# EAGLE design Frontpanel (EAGLE 7.7.0)
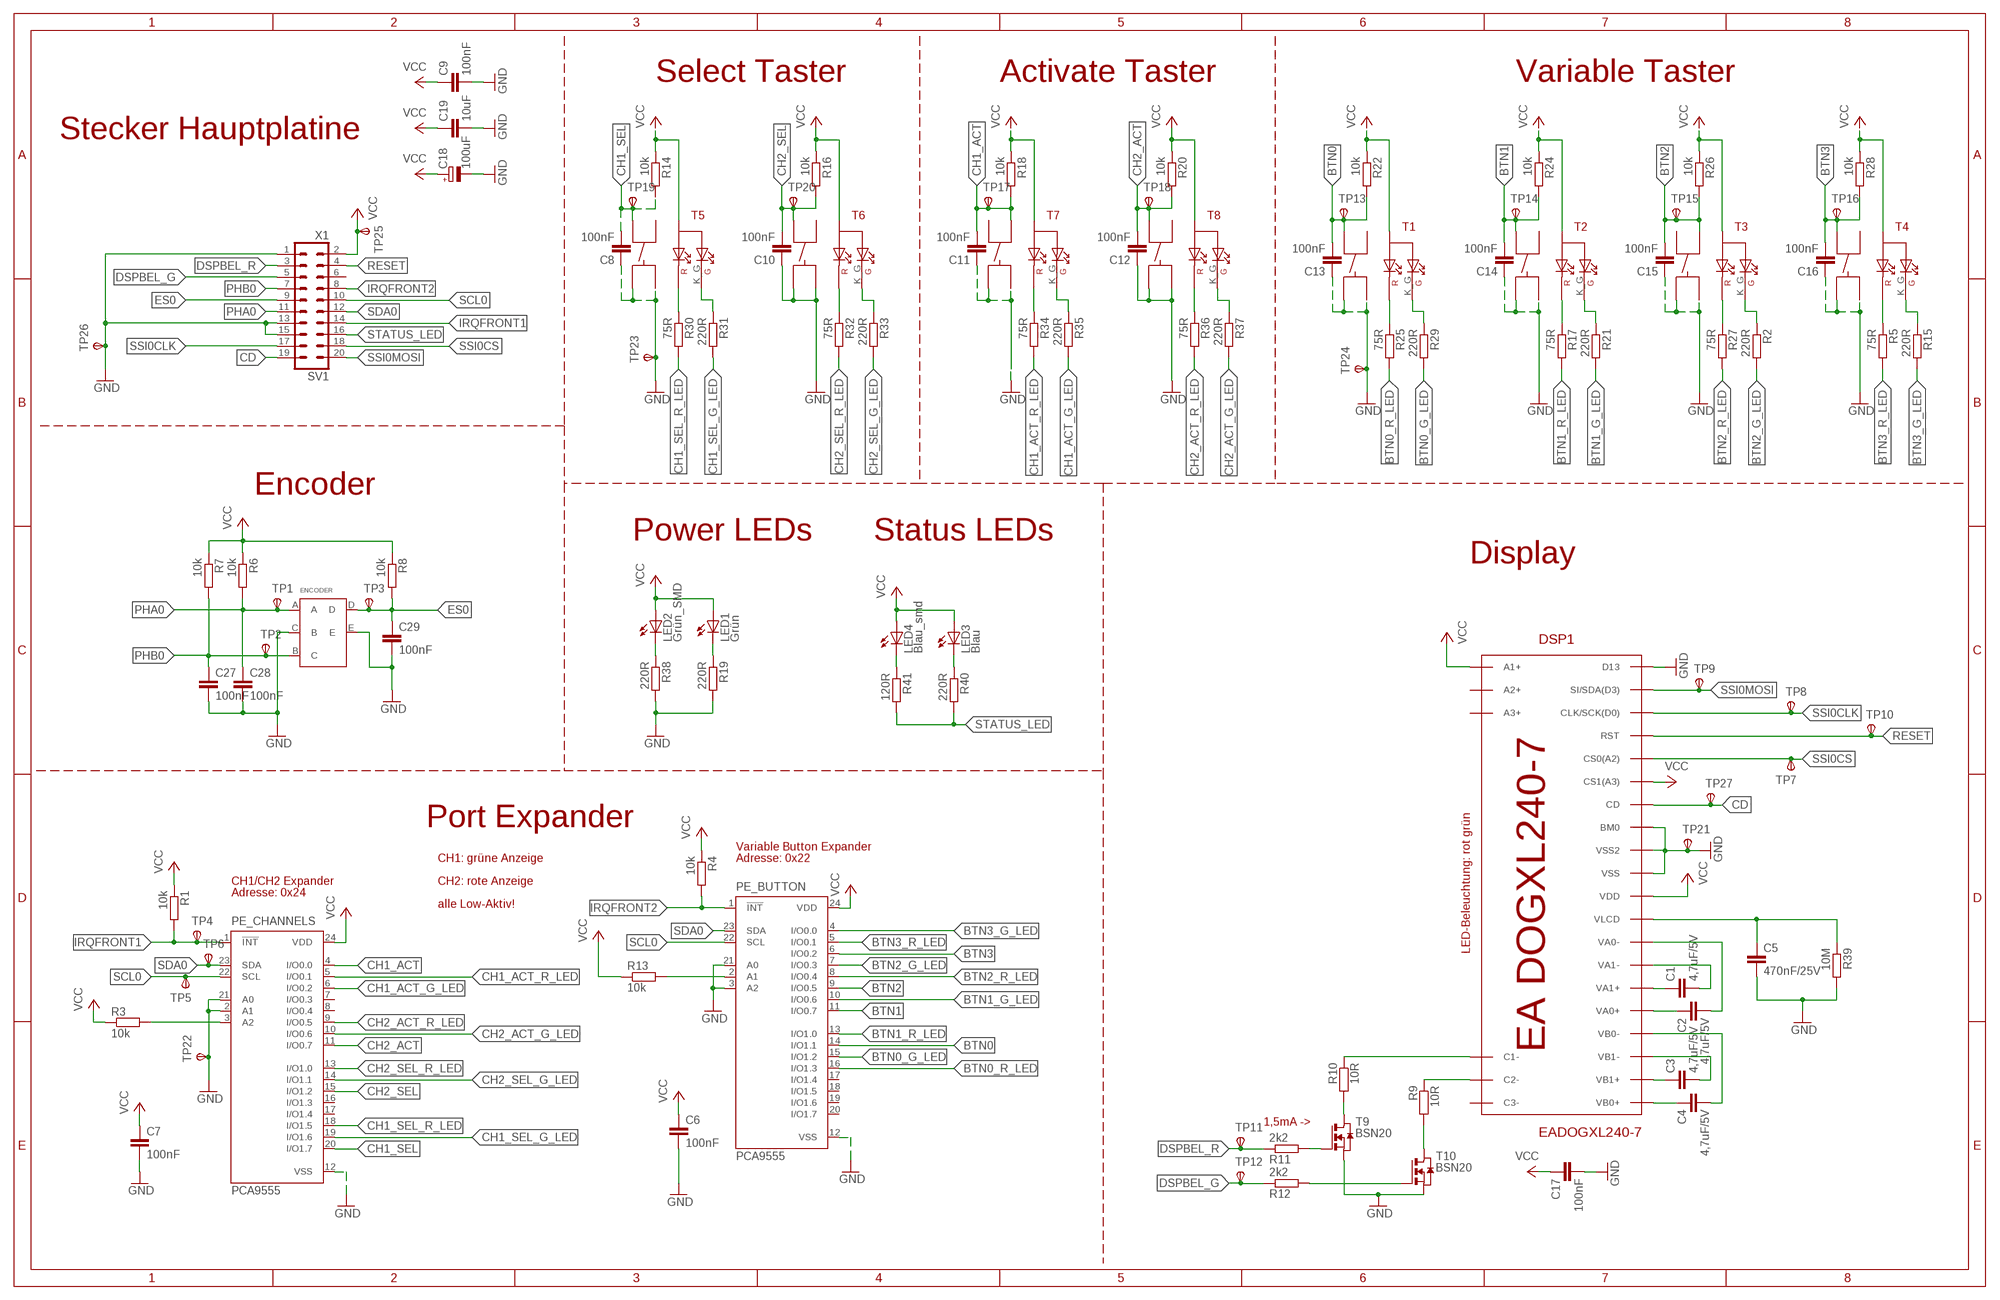
[diagram p0: schematic, sheet 1]

## Parts
C1  4,7uF/5V  C-EUC0805  [C0805]
C2  4,7uF/5V  C-EUC0805  [C0805]
C3  4,7uF/5V  C-EUC0805  [C0805]
C4  4,7uF/5V  C-EUC0805  [C0805]
C5  470nF/25V  C-EUC0603  [C0603]
C6  100nF  C-EUC0603  [C0603]
C7  100nF  C-EUC0603  [C0603]
C8  100nF  C-EUC0603  [C0603]
C9  100nF  C-EUC0603  [C0603]
C10  100nF  C-EUC0603  [C0603]
C11  100nF  C-EUC0603  [C0603]
C12  100nF  C-EUC0603  [C0603]
C13  100nF  C-EUC0603  [C0603]
C14  100nF  C-EUC0603  [C0603]
C15  100nF  C-EUC0603  [C0603]
C16  100nF  C-EUC0603  [C0603]
C17  100nF  C-EUC0603  [C0603]
C18  100uF  CPOL-EUCT7343  [CT7343]
C19  10uF  C-EUC0805  [C0805]
C27  100nF  C-EUC0603  [C0603]
C28  100nF  C-EUC0603  [C0603]
C29  100nF  C-EUC0603  [C0603]
DSP1  EADOGXL240-7  [EADOGXL240-7]
ENCODER  ENCODER  [ENCODER]
LED1  Grün  LED5MM  [LED5MM]
LED2  Grün_SMD  LEDCHIP-LED0603  [CHIP-LED0603]
LED3  Blau  LED5MM  [LED5MM]
LED4  Blau_smd  LEDCHIP-LED0603  [CHIP-LED0603]
PE_BUTTON  PCA9555  [SSOP24_DBQ]
PE_CHANNELS  PCA9555  [SSOP24_DBQ]
R1  10k  R-EU_R0603  [R0603]
R2  220R  R-EU_R0603  [R0603]
R3  10k  R-EU_R0603  [R0603]
R4  10k  R-EU_R0603  [R0603]
R5  75R  R-EU_R0603  [R0603]
R6  10k  R-EU_R0603  [R0603]
R7  10k  R-EU_R0603  [R0603]
R8  10k  R-EU_R0603  [R0603]
R9  10R  R-EU_M1206  [M1206]
R10  10R  R-EU_M1206  [M1206]
R11  2k2  R-EU_R0603  [R0603]
R12  2k2  R-EU_R0603  [R0603]
R13  10k  R-EU_R0603  [R0603]
R14  10k  R-EU_R0603  [R0603]
R15  220R  R-EU_R0603  [R0603]
R16  10k  R-EU_R0603  [R0603]
R17  75R  R-EU_R0603  [R0603]
R18  10k  R-EU_R0603  [R0603]
R19  220R  R-EU_R0603  [R0603]
R20  10k  R-EU_R0603  [R0603]
R21  220R  R-EU_R0603  [R0603]
R22  10k  R-EU_R0603  [R0603]
R24  10k  R-EU_R0603  [R0603]
R25  75R  R-EU_R0603  [R0603]
R26  10k  R-EU_R0603  [R0603]
R27  75R  R-EU_R0603  [R0603]
R28  10k  R-EU_R0603  [R0603]
R29  220R  R-EU_R0603  [R0603]
R30  75R  R-EU_R0603  [R0603]
R31  220R  R-EU_R0603  [R0603]
R32  75R  R-EU_R0603  [R0603]
R33  220R  R-EU_R0603  [R0603]
R34  75R  R-EU_R0603  [R0603]
R35  220R  R-EU_R0603  [R0603]
R36  75R  R-EU_R0603  [R0603]
R37  220R  R-EU_R0603  [R0603]
R38  220R  R-EU_R0603  [R0603]
R39  10M  R-EU_R0603  [R0603]
R40  220R  R-EU_R0603  [R0603]
R41  120R  R-EU_R0603  [R0603]
SV1  X1  ML20  [ML20]
T1  TASTER_2FSH9_E_BEL  [TASTER_3FSH9_SMD_E]
T2  TASTER_2FSH9_E_BEL  [TASTER_3FSH9_SMD_E]
T3  TASTER_2FSH9_E_BEL  [TASTER_3FSH9_SMD_E]
T4  TASTER_2FSH9_E_BEL  [TASTER_3FSH9_SMD_E]
T5  TASTER_2FSH9_E_BEL  [TASTER_3FSH9_SMD_E]
T6  TASTER_2FSH9_E_BEL  [TASTER_3FSH9_SMD_E]
T7  TASTER_2FSH9_E_BEL  [TASTER_3FSH9_SMD_E]
T8  TASTER_2FSH9_E_BEL  [TASTER_3FSH9_SMD_E]
T9  BSN20  NMOSSOT23  [SOT-23]
T10  BSN20  NMOSSOT23  [SOT-23]
TP1  TPSB1,27  [B1,27]
TP2  TPSB1,27  [B1,27]
TP3  TPSB1,27  [B1,27]
TP4  TPSB1,27  [B1,27]
TP5  TPSB1,27  [B1,27]
TP6  TPSB1,27  [B1,27]
TP7  TPSB1,27  [B1,27]
TP8  TPSB1,27  [B1,27]
TP9  TPSB1,27  [B1,27]
TP10  TPSB1,27  [B1,27]
TP11  TPSB1,27  [B1,27]
TP12  TPSB1,27  [B1,27]
TP13  TPSB1,27  [B1,27]
TP14  TPSB1,27  [B1,27]
TP15  TPSB1,27  [B1,27]
TP16  TPSB1,27  [B1,27]
TP17  TPSB1,27  [B1,27]
TP18  TPSB1,27  [B1,27]
TP19  TPSB1,27  [B1,27]
TP20  TPSB1,27  [B1,27]
TP21  TPSB1,27  [B1,27]
TP22  TPSB1,27  [B1,27]
TP23  TPSB1,27  [B1,27]
TP24  TPSB1,27  [B1,27]
TP25  TPSB1,27  [B1,27]
TP26  TPSB1,27  [B1,27]
TP27  TPSB1,27  [B1,27]

## Nets
BTN0: C13.2 PE_BUTTON.14(I/O1.1) R22.2 T1.13 TP13.TP(PP)
BTN0_G_LED: PE_BUTTON.15(I/O1.2) R29.2
BTN0_R_LED: PE_BUTTON.16(I/O1.3) R25.2
BTN1: C14.2 PE_BUTTON.11(I/O0.7) R24.2 T2.13 TP14.TP(PP)
BTN1_G_LED: PE_BUTTON.10(I/O0.6) R21.2
BTN1_R_LED: PE_BUTTON.13(I/O1.0) R17.2
BTN2: C15.2 PE_BUTTON.9(I/O0.5) R26.2 T3.23 TP15.TP(PP)
BTN2_G_LED: PE_BUTTON.7(I/O0.3) R2.2
BTN2_R_LED: PE_BUTTON.8(I/O0.4) R27.2
BTN3: C16.2 PE_BUTTON.6(I/O0.2) R28.2 T4.13 TP16.TP(PP)
BTN3_G_LED: PE_BUTTON.4(I/O0.0) R15.2
BTN3_R_LED: PE_BUTTON.5(I/O0.1) R5.2
CD: DSP1.CD SV1.19 TP27.TP(PP)
CH1_ACT: C11.2 PE_CHANNELS.4(I/O0.0) R18.2 T7.23 TP17.TP(PP)
CH1_ACT_G_LED: PE_CHANNELS.6(I/O0.2) R35.2
CH1_ACT_R_LED: PE_CHANNELS.5(I/O0.1) R34.2
CH1_SEL: C8.2 PE_CHANNELS.20(I/O1.7) R14.2 T5.13 TP19.TP(PP)
CH1_SEL_G_LED: PE_CHANNELS.19(I/O1.6) R31.2
CH1_SEL_R_LED: PE_CHANNELS.18(I/O1.5) R30.2
CH2_ACT: C12.2 PE_CHANNELS.11(I/O0.7) R20.2 T8.13 TP18.TP(PP)
CH2_ACT_G_LED: PE_CHANNELS.10(I/O0.6) R37.2
CH2_ACT_R_LED: PE_CHANNELS.9(I/O0.5) R36.2
CH2_SEL: C10.2 PE_CHANNELS.15(I/O1.2) R16.2 T6.13 TP20.TP(PP)
CH2_SEL_G_LED: PE_CHANNELS.14(I/O1.1) R33.2
CH2_SEL_R_LED: PE_CHANNELS.13(I/O1.0) R32.2
DSPBEL_G: R12.1 SV1.5 TP12.TP(PP)
DSPBEL_R: R11.1 SV1.3 TP11.TP(PP)
ES0: C29.1 ENCODER.D R8.2 SV1.9 TP3.TP(PP)
GND: C5.2 C6.2 C7.2 C8.1 C9.2 C10.1 C11.1 C12.1 C13.1 C14.1 C15.1 C16.1 C17.2 C18.- C19.2 C27.2 C28.2 C29.2 DSP1.BM0 DSP1.D13 DSP1.VSS1(VSS) DSP1.VSS2 ENCODER.C(B) ENCODER.E PE_BUTTON.3(A2) PE_BUTTON.12(VSS) PE_BUTTON.21(A0) PE_CHANNELS.2(A1) PE_CHANNELS.12(VSS) PE_CHANNELS.21(A0) R19.2 R38.2 R39.2 SV1.1 SV1.13 SV1.15 T1.14 T1.24 T2.14 T2.24 T3.14 T3.24 T4.14 T4.24 T5.14 T5.24 T6.14 T6.24 T7.14 T7.24 T8.14 T8.24 T9.2(S) T10.2(S) TP21.TP(PP) TP22.TP(PP) TP23.TP(PP) TP24.TP(PP) TP26.TP(PP)
IRQFRONT1: PE_CHANNELS.1(!INT) R1.2 SV1.14 TP4.TP(PP)
IRQFRONT2: PE_BUTTON.1(!INT) R4.2 SV1.8
N$1: PE_CHANNELS.3(A2) R3.2
N$2: R27.1 T3.K_R(KR)
N$3: DSP1.C1- R10.1
N$4: PE_BUTTON.2(A1) R13.2
N$5: R11.2 T9.3(G)
N$6: DSP1.C2- R9.1
N$7: R12.2 T10.3(G)
N$8: R29.1 T1.K_G(KG)
N$9: R25.1 T1.K_R(KR)
N$10: R17.1 T2.K_R(KR)
N$11: C1.1 DSP1.VA1+
N$12: C2.1 DSP1.VA0+
N$13: C3.1 DSP1.VB1+
N$14: C4.1 DSP1.VB0+
N$15: C3.2 DSP1.VB1-
N$16: C4.2 DSP1.VB0-
N$17: R9.2 T10.1(D)
N$18: R10.2 T9.1(D)
N$19: R21.1 T2.K_G(KG)
N$20: R36.1 T8.K_R(KR)
N$21: R2.1 T3.K_G(KG)
N$22: R5.1 T4.K_R(KR)
N$23: R15.1 T4.K_G(KG)
N$24: R37.1 T8.K_G(KG)
N$25: R34.1 T7.K_R(KR)
N$26: R35.1 T7.K_G(KG)
N$27: R32.1 T6.K_R(KR)
N$28: R33.1 T6.K_G(KG)
N$29: R30.1 T5.K_R(KR)
N$30: R31.1 T5.K_G(KG)
N$31: C1.2 DSP1.VA1-
N$32: LED1.K(C) R19.1
N$33: LED2.C R38.1
N$34: C2.2 DSP1.VA0-
N$35: LED3.K(C) R40.1
N$36: C5.1 DSP1.VLCD R39.1
N$37: LED4.C R41.1
PHA0: C28.1 ENCODER.A R6.2 SV1.11 TP1.TP(PP)
PHB0: C27.1 ENCODER.B(C) R7.2 SV1.7 TP2.TP(PP)
RESET: DSP1.RST SV1.4 TP10.TP(PP)
SCL0: PE_BUTTON.22(SCL) PE_CHANNELS.22(SCL) SV1.10 TP5.TP(PP)
SDA0: PE_BUTTON.23(SDA) PE_CHANNELS.23(SDA) SV1.12 TP6.TP(PP)
SSI0CLK: DSP1.SCK(D0)(CLK/SCK(D0)) SV1.17 TP8.TP(PP)
SSI0CS: DSP1.CS0(A2) SV1.18 TP7.TP(PP)
SSI0MOSI: DSP1.SDA(D3)(SI/SDA(D3)) SV1.20 TP9.TP(PP)
STATUS_LED: R40.2 R41.2 SV1.16
VCC: C6.1 C7.1 C9.1 C17.1 C18.+ C19.1 DSP1.A1+ DSP1.CS1(A3) DSP1.VDD LED1.A LED2.A LED3.A LED4.A PE_BUTTON.24(VDD) PE_CHANNELS.24(VDD) R1.1 R3.1 R4.1 R6.1 R7.1 R8.1 R13.1 R14.1 R16.1 R18.1 R20.1 R22.1 R24.1 R26.1 R28.1 SV1.2 T1.A T2.A T3.A T4.A T5.A T6.A T7.A T8.A TP25.TP(PP)
Unconnected: DSP1.A2+ DSP1.A3+ DSP1.C3- PE_BUTTON.17(I/O1.4) PE_BUTTON.18(I/O1.5) PE_BUTTON.19(I/O1.6) PE_BUTTON.20(I/O1.7) PE_CHANNELS.7(I/O0.3) PE_CHANNELS.8(I/O0.4) PE_CHANNELS.16(I/O1.3) PE_CHANNELS.17(I/O1.4) SV1.6 T1.23 T2.23 T3.13 T4.23 T5.23 T6.23 T7.13 T8.23

## Notes on the sheet
- Select Taster | Activate Taster | Variable Taster
- Stecker Hauptplatine
- Encoder
- Power LEDs | Status LEDs
- Display
- Port Expander
- Variable Button Expander
- CH1: grüne Anzeige | Adresse: 0x22
- CH1/CH2 Expander | CH2: rote Anzeige
- Adresse: 0x24
- alle Low-Aktiv!
- LED-Beleuchtung: rot grün
- 1,5mA ->

## Library data of the parts
C1-C17 C19 C27-C29 = resistor:C-EU: CAPACITOR, European symbol
C18 = resistor:CPOL-EU: POLARIZED CAPACITOR, European symbol
DSP1 = ea_dogxl240-7:EADOGXL240-7
ENCODER = encoder:ENCODER
LED1-LED4 = led:LED: LED OSRAM: - CHIPLED LG R971, LG N971, LY N971, LG Q971, LY Q971, LO R971, LY R971 LH N974, LH R974 LS Q976, LO Q976, LY Q976 LO Q996 - Hyper CHIPLED LW Q18S LB Q993, LB Q99A, LB R99A - SideLED LS A670, LO A670, LY A670, LG A670, LP A670 LB A673, LV A673, LT A673, LW A673 LH A674 LY A675 LS A676, LA A676, LO A676, LY A676, LW A676 LS A679, LY A679, LG A679 - Hyper Micro SIDELED® LS Y876, LA Y876, LO Y876, LY Y876 LT Y87S - SmartLED LW L88C, LW L88S LB L89C, LB L89S, LG L890 LS L89K, LO L89K, LY L89K LS L896, LA L896, LO L896, LY L896 - TOPLED LS T670, LO T670, LY T670, LG T670, LP T670 LSG T670, LSP T670, LSY T670, LOP T670, LYG T670 LG T671, LOG T671, LSG T671 LB T673, LV T673, LT T673, LW T673 LH T674 LS T676, LA T676, LO T676, LY T676, LB T676, LH T676, LSB T676, LW T676 LB T67C, LV T67C, LT T67C, LS T67K, LO T67K, LY T67K, LW E67C LS E67B, LA E67B, LO E67B, LY E67B, LB E67C, LV E67C, LT E67C LW T67C LS T679, LY T679, LG T679 LS T770, LO T770, LY T770, LG T770, LP T770 LB T773, LV T773, LT T773, LW T773 LH T774 LS E675, LA E675, LY E675, LS T675 LS T776, LA T776, LO T776, LY T776, LB T776 LHGB T686 LT T68C, LB T68C - Hyper Mini TOPLED® LB M676 - Mini TOPLED Santana® LG M470 LS M47K, LO M47K, LY M47K Source: http://www.osram.convergy.de LUXEON: - LUMILED® LXK2-PW12-R00, LXK2-PW12-S00, LXK2-PW14-U00, LXK2-PW14-V00 LXK2-PM12-R00, LXK2-PM12-S00, LXK2-PM14-U00 LXK2-PE12-Q00, LXK2-PE12-R00, LXK2-PE12-S00, LXK2-PE14-T00, LXK2-PE14-U00 LXK2-PB12-K00, LXK2-PB12-L00, LXK2-PB12-M00, LXK2-PB14-N00, LXK2-PB14-P00, LXK2-PB14-Q00 LXK2-PR12-L00, LXK2-PR12-M00, LXK2-PR14-Q00, LXK2-PR14-R00 LXK2-PD12-Q00, LXK2-PD12-R00, LXK2-PD12-S00 LXK2-PH12-R00, LXK2-PH12-S00 LXK2-PL12-P00, LXK2-PL12-Q00, LXK2-PL12-R00 Source: www.luxeon.com KINGBRIGHT: KA-3528ASYC Source: www.kingbright.com
PE_BUTTON PE_CHANNELS = Taster_mec_3F:PCA9555
R1-R22 R24-R41 = resistor:R-EU_: RESISTOR, European symbol
SV1 = con-harting-ml:ML20: HARTING; OC_FARNELL: unknown; OC_NEWARK: unknown
T1-T8 = Taster_mec_3F:TASTER_2FSH9_E_BEL
T9 T10 = zetex:NMOSSOT23: MOS FET; OC_FARNELL: unknown; OC_NEWARK: unknown
TP1-TP27 = testpad:TPS: TEST PIN

## Net classes
0 default: clearance 0.205 mm

## Board
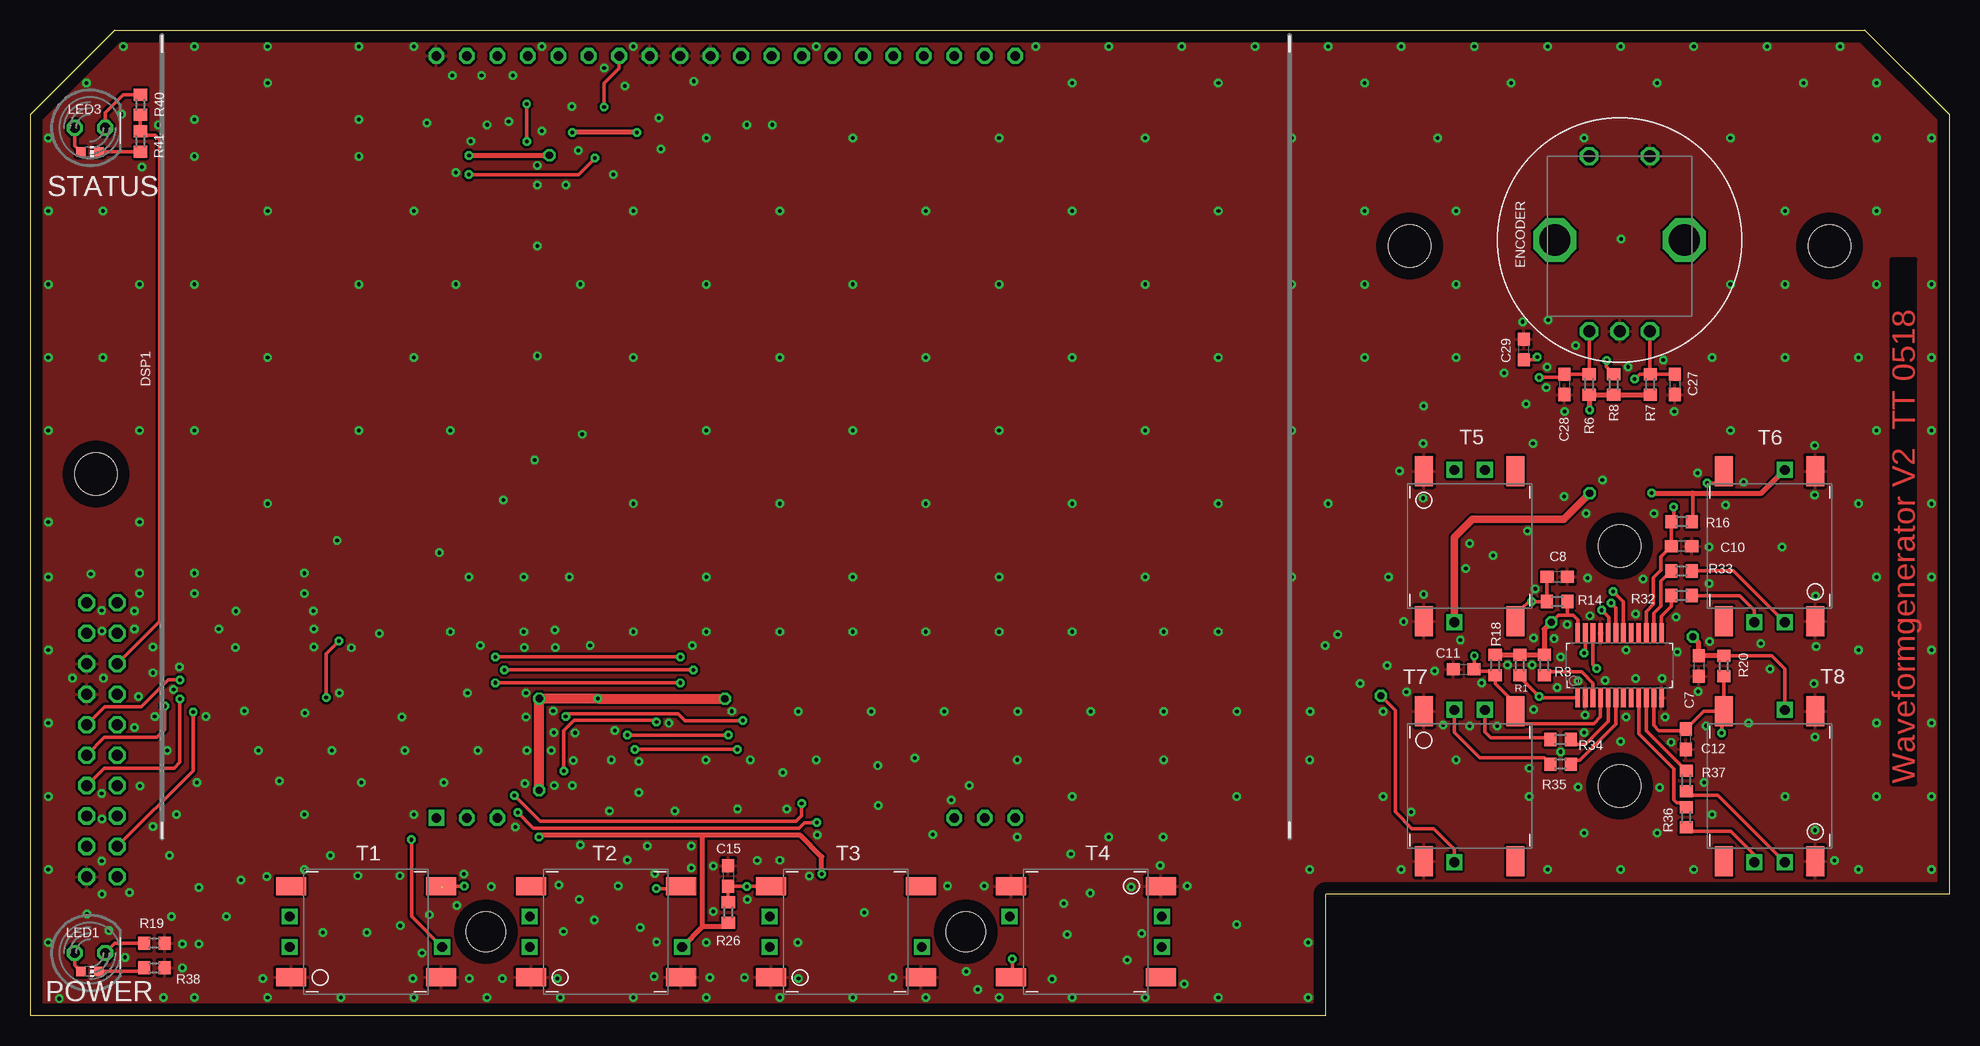
[diagram p1: board, top side]
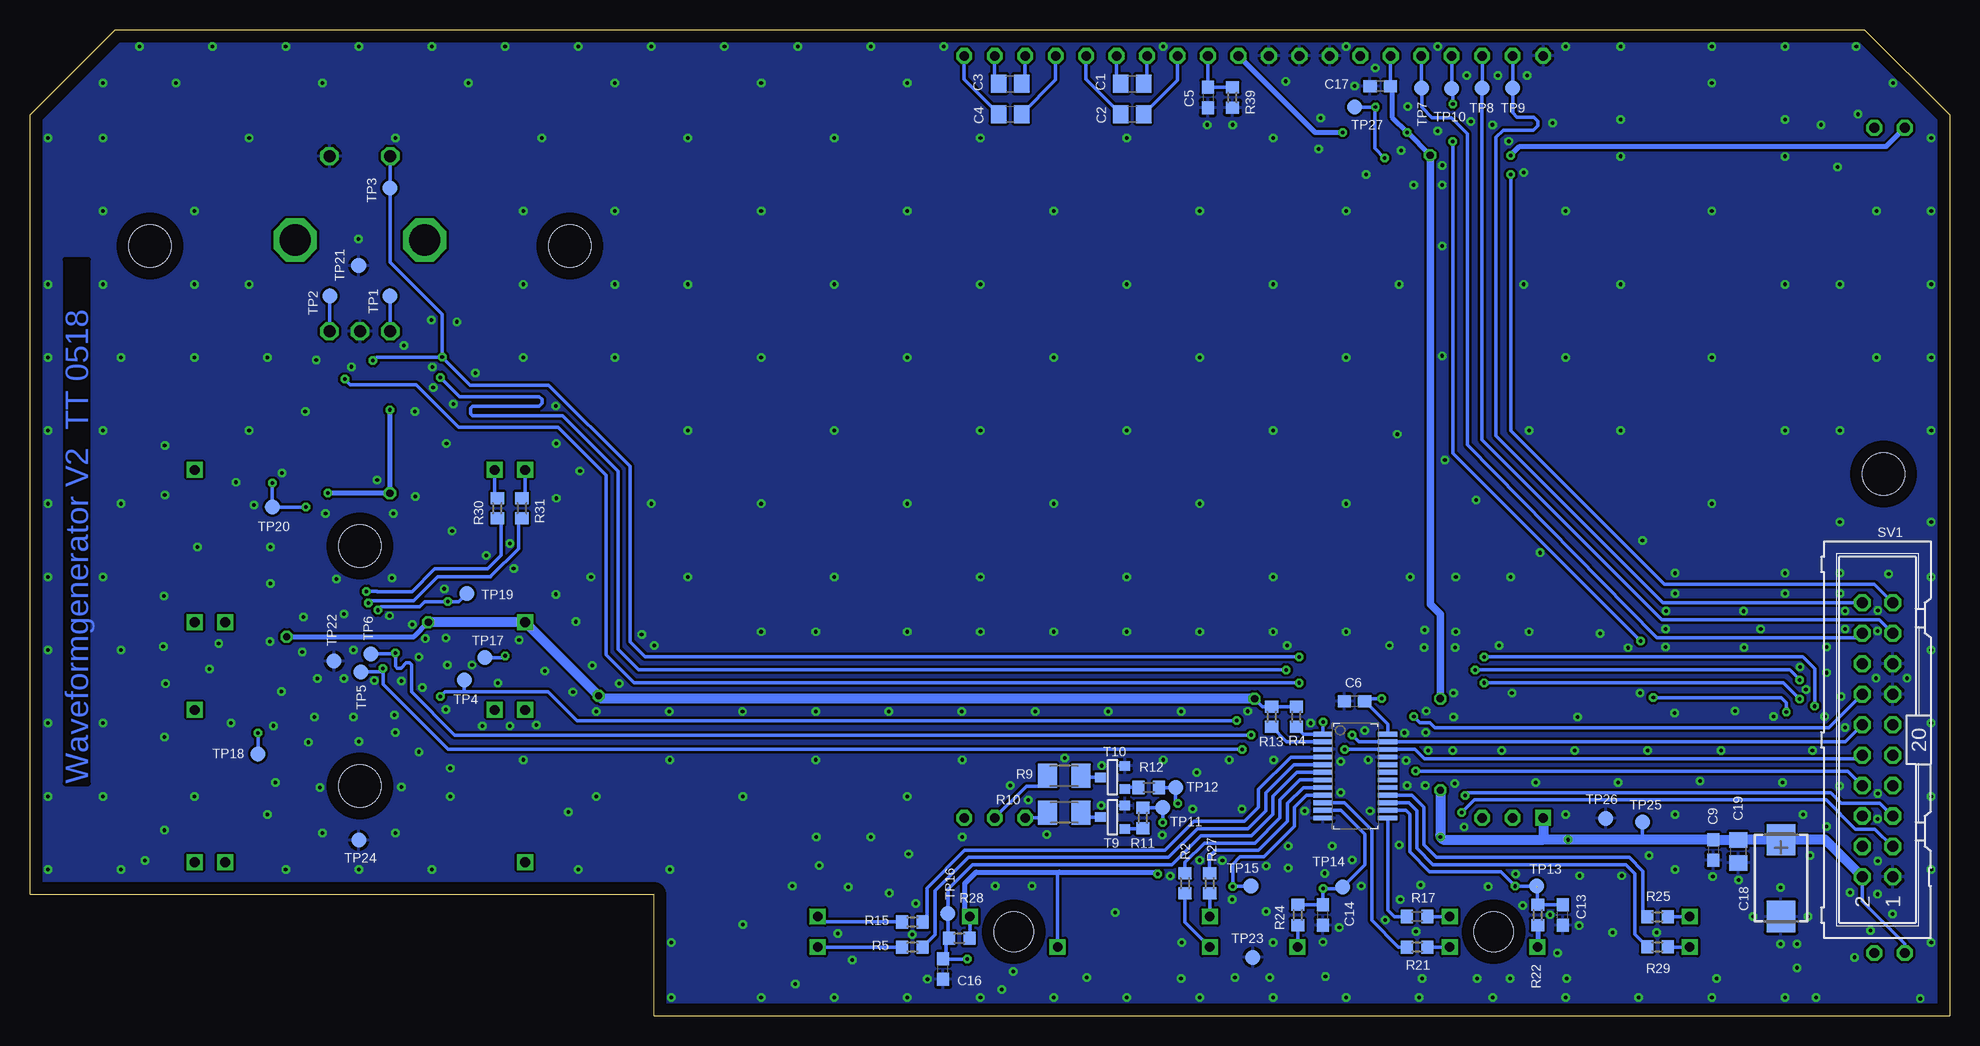
[diagram p2: board, bottom side, seen from below]

Size 160 x 82.15 mm. Coordinates in mm from the lower left corner, seen from the top.
Outline: 7.07,82.15 0,75.08 0,0 108,0 108,10.15 160,10.15 160,75.08 152.93,82.15 7.07,82.15
Copper layers (1*16): Top 0.035mm / dielectric 1.5mm / Bottom 0.035mm
Design rules "default *": minimum track width 6mil, minimum drill 0.3mm, track to track 6mil, track to pad 6mil, pad to pad 6mil, via to via 6mil, smd to smd 6mil, copper to edge 40mil, drill to drill 8mil, minimum pad ring 10mil, minimum via ring 8mil, stop-mask expansion 4mil, vias tented up to drill 0mil, thermal gap 10mil
Holes 3.3 mm at 78,7 38,7
Holes 3.5 mm at 5.5,45.15 132.5,39.15 132.5,19.15 150,64.15 115,64.15

### Footprints (pad centres in the part's own frame; a part is rotated, then mirrored left to right if it is on the bottom)
C0805 = smd 1.3 x 1.5: 1 -0.95,0; 2 0.95,0
C0603 = smd 1.1 x 1: 1 -0.85,0; 2 0.85,0
CT7343 = smd 2.6 x 2.4: + 3.2,0; - -3.2,0
EADOGXL240-7 = drill 0.8 square: A1+ 0,0 | drill 0.8 octagon: A2+ 2.54,0; A3+ 5.08,0; BM0 17.78,63.5; C1- 43.18,0; C2- 45.72,0; C3- 48.26,0; CD 15.24,63.5; CS0(A2) 10.16,63.5; CS1(A3) 12.7,63.5; D13 0,63.5; RST 7.62,63.5; SCK(D0) 5.08,63.5; SDA(D3) 2.54,63.5; VA0+ 38.1,63.5; VA0- 30.48,63.5; VA1+ 35.56,63.5; VA1- 33.02,63.5; VB0+ 48.26,63.5; VB0- 40.64,63.5; VB1+ 45.72,63.5; VB1- 43.18,63.5; VDD 25.4,63.5; VLCD 27.94,63.5; VSS1 22.86,63.5; VSS2 20.32,63.5
ENCODER = drill 1 octagon: A -2.54,-7.62; B 2.54,-7.62; C 0,-7.62; D -2.54,6.985; E 2.54,6.985 | drill 2.6 octagon: P$1 5.397,0; P$2 -5.397,0
LED5MM = drill 0.813 octagon: A -1.27,0; K 1.27,0
CHIP-LED0603 = smd 0.8 x 0.8: A 0,-0.75; C 0,0.75
SSOP24_DBQ = smd 0.4 x 1.6: 1 -3.493,-2.699; 2 -2.857,-2.699; 3 -2.223,-2.699; 4 -1.587,-2.699; 5 -0.953,-2.699; 6 -0.318,-2.699; 7 0.318,-2.699; 8 0.953,-2.699; 9 1.587,-2.699; 10 2.223,-2.699; 11 2.857,-2.699; 12 3.493,-2.699; 13 3.493,2.699; 14 2.857,2.699; 15 2.223,2.699; 16 1.587,2.699; 17 0.953,2.699; 18 0.318,2.699; 19 -0.318,2.699; 20 -0.953,2.699; 21 -1.587,2.699; 22 -2.223,2.699; 23 -2.857,2.699; 24 -3.493,2.699
R0603 = smd 1 x 1.1: 1 -0.85,0; 2 0.85,0
M1206 = smd 1.6 x 2: 1 -1.4,0; 2 1.4,0
ML20 = drill 0.914 octagon: 1 -11.43,-1.27; 2 -11.43,1.27; 3 -8.89,-1.27; 4 -8.89,1.27; 5 -6.35,-1.27; 6 -6.35,1.27; 7 -3.81,-1.27; 8 -3.81,1.27; 9 -1.27,-1.27; 10 -1.27,1.27; 11 1.27,-1.27; 12 1.27,1.27; 13 3.81,-1.27; 14 3.81,1.27; 15 6.35,-1.27; 16 6.35,1.27; 17 8.89,-1.27; 18 8.89,1.27; 19 11.43,-1.27; 20 11.43,1.27
TASTER_3FSH9_SMD_E = smd 1.5 x 2.5: 13 -3.8,6.25; 14 3.8,6.25; 23 -3.8,-6.25; 24 3.8,-6.25 | drill 0.8 square: A 1.27,6.35; K_G 1.27,-6.35; K_R -1.27,-6.35
SOT-23 = smd 0.787 x 0.889: 1 0.025,-1.016; 2 -0.94,1.016; 3 0.991,1.016
B1,27 = smd 1.27 x 1.27: TP 0,0

### Placement (x,y rotation side)
C1  68.12,77.68 0 bottom
C2  68.12,75.15 0 bottom
C3  78.3,77.68 0 bottom
C4  78.3,75.15 0 bottom
C5  61.83,76.53 270 bottom
C6  49.6,26.2 180 bottom
C7  139.1,29.15 270 top
C8  127.3,36.58 180 top
C9  19.7,13.82 270 bottom
C10  137.65,39.12 180 top
C11  119.5,28.88 0 top
C12  138.03,23.05 90 top
C13  32.25,8.4 90 bottom
C14  52.23,8.4 90 bottom
C15  58.2,11.65 270 top
C16  83.88,3.89 90 bottom
C17  47.45,77.47 180 bottom
C18  14.05,11.47 90 bottom
C19  17.62,13.7 270 bottom
C27  137.1,52.62 270 top
C28  127.9,52.62 270 top
C29  124.53,55.52 90 top
DSP1  33.87,16.5 0 top
ENCODER  132.5,64.65 0 top
LED1  5,5.24 0 top
LED2  5,3.7 270 top
LED3  5,74 0 top
LED4  5,72 270 top
PE_BUTTON  49.52,19.98 270 bottom
PE_CHANNELS  132.5,29.2 0 top
R1  124.17,29.23 270 top
R2  63.73,11.05 90 bottom
R3  126.22,29.23 270 top
R4  54.45,24.93 270 bottom
R5  86.45,5.72 0 bottom
R6  129.95,52.62 90 top
R7  135.05,52.62 90 top
R8  132,52.62 90 top
R9  73.79,19.99 0 bottom
R10  73.79,16.94 0 bottom
R11  67.24,16.5 270 bottom
R12  66.74,19.02 180 bottom
R13  56.5,24.93 270 bottom
R14  127.3,34.52 180 top
R15  86.45,7.82 0 bottom
R16  137.68,41.17 180 top
R17  44.38,8.28 180 bottom
R18  122.12,29.23 270 top
R19  10.38,6.05 0 top
R20  141.18,29.15 270 top
R21  44.38,5.72 180 bottom
R22  34.33,8.4 90 bottom
R24  54.33,8.4 90 bottom
R25  24.35,8.25 180 bottom
R26  58.2,8.61 90 top
R27  61.67,11.05 90 bottom
R28  82.54,6.46 180 bottom
R29  24.35,5.75 180 bottom
R30  121.05,42.3 270 bottom
R31  119,42.3 270 bottom
R32  137.65,35.02 180 top
R33  137.65,37.08 180 top
R34  127.58,23.02 0 top
R35  127.58,20.97 0 top
R36  138.05,16.55 90 top
R37  138.05,19.57 90 top
R38  10.38,4 0 top
R39  59.77,76.53 270 bottom
R40  9.2,75.92 270 top
R41  9.2,72.88 90 top
SV1  6,23 90 bottom
T1  28,7 270 top
T2  48,7 270 top
T3  68,7 270 top
T4  88,7 90 top
T5  120,39.15 180 top
T6  145,39.15 0 top
T7  120,19.15 180 top
T8  145,19.15 0 top
T9  69.76,16.57 270 bottom
T10  69.76,19.9 270 bottom
TP1  130,60 0 bottom
TP2  135,60 0 bottom
TP3  130,69 0 bottom
TP4  123.8,28 0 bottom
TP5  132.4,28.66 0 bottom
TP6  131.6,30.15 0 bottom
TP7  44,77.3 0 bottom
TP8  38.98,77.3 0 bottom
TP9  36.4,77.3 0 bottom
TP10  41.5,77.28 0 bottom
TP11  65.58,17.34 0 bottom
TP12  64.52,19.02 0 bottom
TP13  34.4,10.8 0 bottom
TP14  50.6,10.72 0 bottom
TP15  58.23,10.81 0 bottom
TP16  83.49,8.53 0 bottom
TP17  122.1,29.85 0 bottom
TP18  141,21.8 0 bottom
TP19  123.6,35.2 0 bottom
TP20  139.8,42.4 0 bottom
TP21  132.6,62.52 0 bottom
TP22  134.66,29.55 0 bottom
TP23  58.06,4.88 0 bottom
TP24  132.59,14.63 0 bottom
TP25  25.6,16.15 0 bottom
TP26  28.65,16.46 0 bottom
TP27  49.57,75.72 0 bottom

### Tracks (layer width: path | path; a pad name or v marks a point on that pad's centre or on a via)
BTN0  (via drill 0.3)  (1 unrouted)
  Top 0.305: v36.2,10.8 T1.13
  Bottom 0.305: PE_BUTTON.14 45.32,17.12 45,16.8 45,13.66 43.34,12 37.4,12 v36.2,10.8 T1.13 34.35,10.7 34.35,9.28 R22.2 C13.2
BTN0_G_LED
  Bottom 0.305: PE_BUTTON.15 45.06,17.75 44.4,17.09 44.4,13.95 43.05,12.6 27,12.6 26.25,11.85 26.25,6.8 R29.2
BTN0_R_LED
  Bottom 0.305: PE_BUTTON.16 44.8,18.39 43.8,17.39 43.8,14.25 42.75,13.2 26.7,13.2 25.55,12.05 25.55,8.68 25.2,8.33 R25.2
BTN1  (via drill 0.3)
  Top 0.305: T2.13 54.05,10.6 v52.2,10.6
  Bottom 0.305: PE_BUTTON.11 50.72,17.12 48.73,15.12 48.73,12.59 TP14.TP 50.72,10.6 v52.2,10.6 52.23,10.48 C14.2 R24.2
BTN1_G_LED
  Bottom 0.305: R21.2 45.92,5.72 48.16,7.96 48.16,15.46 50.46,17.75 PE_BUTTON.10
BTN1_R_LED
  Bottom 0.305: R17.2 46.27,8.28 46.8,8.8 46.8,16.46 PE_BUTTON.13
BTN2  (via drill 0.3)
  Top 0.305: R26.2 C15.2 v59.73,10.8 v59.74,10.79 59.75,10.8 T3.23
  Bottom 0.305: PE_BUTTON.9 53.61,18.39 54.6,17.4 54.6,15.81 57.15,13.26 59.13,13.26 59.74,12.65 v59.74,10.79 59.17,10.79 TP15.TP
BTN2_G_LED
  Bottom 0.305: 63.73,11.93 R2.2 63.73,12.78 62.1,14.4 57.9,14.4 55.8,16.5 55.8,17.99 54.13,19.66 PE_BUTTON.7
BTN2_R_LED
  Bottom 0.305: R27.2 61.67,13.32 61.2,13.8 57.6,13.8 55.2,16.2 55.2,17.7 53.87,19.02 PE_BUTTON.8
BTN3  (via drill 0.3)
  Top 0.305: T4.13 81.89,3.34 v81.89,4.72
  Bottom 0.305: PE_BUTTON.6 54.39,20.29 56.4,18.29 56.4,16.79 58.19,15 62.4,15 64.8,12.6 81.43,12.6 83.49,10.54 TP16.TP | C16.2 83.98,5.15 | v81.89,4.72 83.86,4.72 C16.2 | 83.49,6.46 83.66,6.46 83.66,4.74 C16.2 | R28.2 83.49,6.46 | 83.49,6.46 TP16.TP | 83.52,8.51 TP16.TP
BTN3_G_LED
  Bottom 0.305: PE_BUTTON.4 54.91,21.56 57.6,18.88 57.6,17.38 58.78,16.2 62.99,16.2 65.39,13.8 82.08,13.8 85.25,10.64 85.25,7.82 R15.2
BTN3_R_LED
  Bottom 0.305: PE_BUTTON.5 54.65,20.93 57,18.58 57,17.09 58.49,15.6 62.7,15.6 65.09,13.2 81.79,13.2 84.58,10.41 84.58,6.74 R5.2
CD  (via drill 0.3)
  Top 0.305: DSP1.CD 49.11,78.98 47.85,77.72 v47.85,75.74 | v36.58,70.1 45.72,70.1 v47.09,71.48
  Bottom 0.305: SV1.19 6.27,35.97 23.77,35.97 36.58,48.77 v36.58,70.1 | TP27.TP 47.88,75.72 v47.85,75.74 47.89,75.7 47.89,72.28 v47.09,71.48
CH1_ACT  (via drill 0.3)
  Top 0.305: PE_CHANNELS.4 130.91,24.91 130.35,24.35 123.8,24.35 T7.23 | 123.8,25 T7.23 | T7.23 123.8,26 122.12,27.68 R18.2 121.78,28.73 120.5,28.73 C11.2 120.39,28.77 v120.39,30
  Bottom 0.305: v120.39,30 120.55,29.85 TP17.TP
CH1_ACT_G_LED
  Top 0.305: PE_CHANNELS.6 132.18,24.29 129.19,21.3 128.78,21.3 128.43,20.95 R35.2
CH1_ACT_R_LED
  Top 0.305: PE_CHANNELS.5 131.55,24.55 129.63,22.63 128.97,22.63 128.57,23.02 R34.2
CH1_SEL  (via drill 0.3)
  Top 0.305: C8.2 R14.2 v125.17,34.52 124.92,34.52 124.4,34 124.4,32.9 T5.13 | PE_CHANNELS.20 131.6,31.95 131.6,33.2 v131,33.8
  Bottom 0.305: TP19.TP 124.28,34.52 v125.17,34.52 127.08,34.52 127.53,34.08 130.72,34.08 v131,33.8
CH1_SEL_G_LED  (via drill 0.3)
  Top 0.305: PE_CHANNELS.19 132.18,34.02 v131.8,34.4
  Bottom 0.305: v131.8,34.4 131.6,34.6 128.01,34.6 126.01,36.6 121.6,36.6 121.6,36.63 119.29,38.93 119.29,41.33 R31.2
CH1_SEL_R_LED  (via drill 0.3)
  Top 0.305: PE_CHANNELS.18 132.82,34.5 v131.96,35.36
  Bottom 0.305: 121.2,41.38 121.2,41.4 | R30.2 120.72,41.45 120.72,38.37 121.85,37.25 126.26,37.25 128.15,35.36 131.06,35.36 131.07,35.36 v131.96,35.36
  Bottom 0.406: R30.2 121.2,41.45 121.2,41.4
CH2_ACT  (via drill 0.3)
  Top 0.305: PE_CHANNELS.11 135.36,24.2 135.79,23.77 137.9,23.77 C12.2 139.53,25.4 T8.13 | T8.13 141,25.2 v141,23.55 | R20.2 141.18,25.43 T8.13
  Bottom 0.305: v141,23.55 TP18.TP
CH2_ACT_G_LED
  Top 0.305: PE_CHANNELS.10 134.72,23.75 R37.2
CH2_ACT_R_LED
  Top 0.305: R36.2 137.7,17.75 137.28,17.75 137,18.02 137,20.58 134.09,23.49 PE_CHANNELS.9
CH2_SEL  (via drill 0.3)
  Top 0.305: T6.13 140.88,45.08 141.2,44.75 | 141.07,45.27 T6.13 | 136.8,39.02 C10.2 | C10.2 136.82,39.15 R16.2 137,41.35 v137,42.4 | v139.8,44.4 141.2,44.4 T6.13 | PE_CHANNELS.15 134.72,33.68 135.33,34.29 135.33,36.52 135.94,37.12 135.94,38.27 C10.2
  Bottom 0.305: v137,42.4 TP20.TP v139.8,44.4
CH2_SEL_G_LED
  Top 0.305: 136.65,37.08 R33.2 135.94,36.22 135.94,34.14 135.36,33.55 PE_CHANNELS.14
CH2_SEL_R_LED
  Top 0.305: PE_CHANNELS.13 135.99,33.3 136.8,34.11 R32.2
DSPBEL_G  (via drill 0.3)
  Top 0.305: v40.39,18.36 42.53,16.22 42.53,16.2 63.86,16.2 64.31,16.66 v64.31,17.68
  Bottom 0.305: v40.39,18.36 40.15,18.6 9.9,18.6 9.02,17.72 5.8,17.72 SV1.5 | R12.1 TP12.TP 64.52,17.88 v64.31,17.68
DSPBEL_R  (via drill 0.3)
  Top 0.305: v40.66,16.94 41.95,15.65 64.11,15.65 64.57,16.11 v65.58,16.11
  Bottom 0.305: v40.66,16.94 39.6,18 10.28,18 7.85,15.57 6.24,15.57 4.79,14.11 SV1.3 | v65.58,16.11 TP11.TP R11.1
ES0  (via drill 0.3)
  Top 0.305: v38.8,29.9 v54.2,29.9 | v125.64,54.9 125.42,54.67 C29.1 | v131.4,54.6 131.4,54.08 R8.2 | v11.24,25.8 11.24,23.86 10.58,23.2 6.2,23.2 SV1.9
  Bottom 0.305: ENCODER.D 129.96,69.04 TP3.TP 130,62.8 125.64,58.44 v125.64,54.9 | v11.24,25.8 11.24,28.92 12.22,29.9 v38.8,29.9 | v125.64,54.9 123.3,52.55 116.75,52.55 110,45.8 110,31.15 108.75,29.9 v54.2,29.9 | v125.64,54.9 131.1,54.9 v131.4,54.6
GND  (via drill 0.3, 0.3 pad 0.51)
  other vias: 127.3,27.35 129.64,25.07 125.33,25.52 133.05,24.9 136.3,24.9 133.85,28.1 136.05,28.1 133.05,30.5 127.59,29.91 129.85,36.5 133.85,33.5 137.2,33.24 127.03,31.42 136.8,22.8 135.85,19.03 78.05,3.7 38.44,10.76 8.72,24.02 10.4,24.93 9.03,26.61 14.67,24.93 25.79,26.91 26.78,30.67 23.66,30.72 10.25,30.72 5.06,36.82 9.18,19.14 3.54,28.13 5.98,18.53 6,16.4 5.98,12.89 11.62,13.35 10.25,15.79 4.76,8.47 24.42,6.95 33.3,8.42 35.58,9.18 32.69,5.22 17.6,11.32 19.73,11.62 14.09,5.98 12.72,5.98 14.09,10.71 16.38,8.27 11.81,8.27 40.46,15.74 45.89,14.23 44.48,7.01 56.67,3.2 59.56,3.2 71.91,3.2 96.44,10.82 88.37,10.21 62.76,20.27 78.31,19.21 58.49,25.38 53.24,24.38 45.21,19.19 41.25,19.34 55.12,14.16 53.75,17.06 51.46,14.16 49.02,10.81 60.61,12.94 56.34,21.32 65.63,15.08 62.49,12.96 75.26,15.09 114.73,26.98 117.78,24.24 129.06,19.05 139.7,24.17 139.55,19.44 145.03,28.89 148.69,27.67 148.84,34.99 140,31.18 144.27,31.02 119.99,24.15 114.5,32.84 119.23,31.32 125.33,31.47 125.48,35.58 119.69,37.26 116.18,35.13 116.18,50.82 124.72,50.98 126.39,52.35 127.92,50.37 137.06,50.37 136.15,54.63 128.83,55.85 126.54,57.99 124.41,57.83 122.89,53.57 107.95,30.86 109.02,31.77 113.13,29.18 117.1,28.73 115.11,16.99 86.16,9.37 91.8,10.74 55.22,30.86 41.35,24.92 41.35,26.9 30.99,24.92 22.91,25.22 36.48,26.9 37.54,30.86 17.12,30.71 12.47,29.05 13.92,19.43 27.64,19.43 8.28,10.29 6,10.13 19.41,3.12 36.63,3.12 39.37,3.12 43.94,3.12 31.9,3.12 49.58,77.49 45.77,9.68 52.02,3.27 64.06,3.12 69.55,8.61 59.79,9.68 64.97,11.66 79,2.21 96.22,2.67 86.77,13.49 148.79,15.47 38.1,74.25 42.67,73.72 35.51,70.29 44.66,69.22 47.86,78.98 59.74,74.25 61.88,74.25 10.7,74.25 9.33,70.75 158.5,12.19 152.4,12.19 158.5,24.38 158.5,36.58 158.5,48.77 158.5,60.96 158.5,73.15 1.52,73.15 1.52,60.96 1.52,48.77 1.52,36.58 1.52,24.38 1.52,12.19 2.44,1.42 13.72,1.52 25.91,1.52 99.06,1.52 106.53,1.52 106.68,12.19 138.68,12.19 126.49,12.19 114.3,12.19 150.88,80.77 138.68,80.77 126.49,80.77 114.3,80.77 102.11,80.77 89.92,80.77 65.53,80.77 50.29,80.77 42.67,80.77 32,80.77 19.81,80.77 7.77,80.77 9.14,48.77 9.14,41.15 1.52,41.15 129.54,15.24 135.64,15.24 132.59,22.86 153.92,60.96 146.3,60.96 146.3,67.06 153.92,67.06 118.87,67.06 111.25,67.06 111.25,60.96 118.87,60.96 106.68,21.34 94.49,21.34 82.3,21.34 73.76,21.49 70.67,20.84 60.05,21.34 58.98,17.22 70.71,17.53 50.75,21.18 48.46,21.34 48.31,17.07 48.76,23.77 70.13,25.35 82.32,25.35 94.51,25.35 106.7,25.35 112.8,25.35 110.89,27.71 94.22,12.54 12.19,16.76 32,16.76 22.86,16.76 22.86,12.19 13.72,60.96 27.43,60.96 35.51,60.96 45.87,60.96 35.05,48.77 27.43,48.77 13.72,48.77 13.72,71.63 13.72,74.68 27.43,71.63 27.43,74.68 13.72,36.88 22.86,36.88 25.6,39.62 36.58,36.58 29.11,31.85 42.06,46.33 41.15,36.58 9.14,60.96 9.14,36.88 56.39,60.96 68.58,60.96 80.77,60.96 92.96,60.96 105.16,60.96 56.39,48.77 46.02,48.46 68.58,48.77 80.77,48.77 92.96,48.77 44.96,36.58 56.39,36.58 68.58,36.58 80.77,36.58 92.96,36.58 105.16,48.77 105.16,36.58 92.96,73.15 105.16,73.15 80.77,73.15 68.58,73.15 56.39,73.15 48.62,70.1 117.35,73.15 129.54,73.15 141.73,73.15 153.92,73.15 141.73,60.96 141.73,48.77 153.92,48.77 153.92,36.58 153.92,24.38 82.28,14.89 79.53,10.82 76.48,10.82 94.47,14.89 86.87,67.06 74.68,67.06 62.48,67.06 99.06,67.06 99.06,77.72 86.87,77.72 86.87,54.86 99.06,54.86 74.68,54.86 74.68,42.67 86.87,42.67 99.06,42.67 62.48,42.67 62.48,54.86 50.29,54.86 50.29,42.67 50.29,67.06 111.25,54.86 74.68,32 86.87,32 99.06,32 108.2,42.67 62.48,32 50.29,32 19.81,42.67 19.81,54.86 19.81,67.06 32,67.06 32,54.86 6.1,54.86 6.1,67.06 19.81,77.72 13.72,80.77 27.43,80.77 1.52,67.06 1.52,54.86 1.52,30.48 1.52,18.29 11.13,1.52 19.81,1.52 32,1.52 38.1,1.52 44.2,1.52 50.29,1.52 56.39,1.52 62.48,1.52 68.58,1.52 74.68,1.52 80.77,1.52 86.87,1.52 92.96,1.52 106.53,6.1 132.59,12.19 158.5,18.29 158.5,30.48 152.4,30.48 152.4,42.67 158.5,42.67 152.4,54.86 158.5,54.86 140.21,54.86 111.25,77.72 123.44,77.72 135.64,77.72 147.83,77.72 153.92,77.72 144.78,80.77 132.59,80.77 120.4,80.77 108.2,80.77 96.01,80.77 83.82,80.77 4.72,77.72 86.87,18.29 100.58,18.29 112.78,18.29 124.97,18.29 118.87,21.34 143.26,24.38 146.3,18.29 100.58,7.62 55.12,12.33 52.07,11.88 56.95,8.68 56.95,12.49 17.87,25.39 12.72,4 28.08,6.95 27.32,11.67 25.03,13.35 30.82,11.67 36.15,11.82 30.86,7.51 44.1,10.89 34.49,19.43 20.78,19.58 139.04,27.03 148.79,23.22 139.96,39.07 130.02,33.34 120.01,39.37 121.95,38.37 129.72,41.87 135.36,41.87 134.44,36.38 139.01,45.22 142.82,44.46 148.77,43.4 148.77,47.51 132.61,64.73 114.15,45.42 116.13,47.7 113.23,36.58 150.42,12.95 137.31,30.33 124.82,40.39 127.86,43.28 131.06,44.65 116.13,43.13 148.89,30.78 47.05,7.97 49.79,13 52.23,6.14 50.86,7.36 63.09,17.22 45.43,23.59 43.61,25.41 46.69,30.86 45.28,21.26 43.68,23.62 11.98,27.2 10.25,28.59 41.2,30.71 43.79,30.71 43.45,22.12 37.34,22.12 31.25,22.12 25.15,22.12 19.06,22.12 11.44,22.12 41.4,22.12 39.9,74.54 40.24,78.37 37.65,78.37 33.07,74.4 36.73,72.88 34.14,38.59 43.69,19.19 1.52,6.1 65.53,21.34 126.45,54.08 133.21,54.08 64.03,25.35 76.22,25.35 88.41,25.35 100.61,25.35 94.49,32 80.77,32 68.58,32 56.39,32 43.74,32.16 41.15,32 35.05,32 56.39,6.1 64.01,6.1 85.19,3.05 92.66,6.86 91.46,4.66 86.45,6.78 89.9,14.89 140.21,16.76 153.92,18.29 146.05,39.07 146.3,54.86 125.27,47.7 118.87,54.86 6.59,7.1 50.75,18.59 129.54,23.62 123.15,29.23 125.21,29.23 139.96,36.03 141.33,42.58 129.06,27.91 131.3,27.93 6.13,28.13 127.57,22 124.98,20.63 122.28,24.15 8.72,32.25 23.66,32.25 15.73,32.25 17.15,33.72 23.63,33.72 8.7,33.72 9.14,35.2 13.72,35.2 22.86,35.2 5.98,33.77 6,32.07 35.21,78.37 120.99,27.74 128.12,32.62 7.62,75.13 39.47,42.98 42.3,69.23 42.28,64.17 42.29,55 42.27,70.88 45.72,72.12 45.17,75.79 52.43,74.83 55.32,77.88 52.58,72.24 76.78,17.99 7.92,4.88
  pour Bottom: 0,0 108,0 108,10 160,10 160,75 152,83 6,83 0,77
  pour Top: 7.15,82.24 152.91,82.24 160,75 160,10 108,10 108,0 0,0 0,75.09
IRQFRONT1  (via drill 0.3)
  Top 0.305: v59.4,24.6 54.6,24.6 54.01,25.19 44.88,25.19 v44.65,24.95 | PE_CHANNELS.1 125.9,26.5 v125.8,26.6 124.17,28.23 R1.2
  Bottom 0.305: 123.8,27 116.8,27 114.4,24.6 v59.4,24.6 | TP4.TP 123.8,27 | 123.8,27 125.4,27 v125.8,26.6 | SV1.14 10.08,24 42.9,24 43.33,24.43 44.13,24.43 v44.65,24.95
IRQFRONT2  (via drill 0.3)
  Top 0.305: v44.49,20.4 44.49,23.75 45.37,24.63 52.07,24.63 v52.23,24.48
  Bottom 0.305: v44.49,20.4 8.48,20.4 SV1.8 | 54.12,24.4 R4.2 53.84,23.47 PE_BUTTON.1 v52.23,24.48
N$1
  Top 0.305: PE_CHANNELS.3 130.28,27.72 129.35,28.65 126.5,28.65 R3.2
N$2
  Bottom 0.305: R27.1 61.65,10.18 T3.K_R
N$3
  Bottom 0.305: DSP1.C1- 75.63,16.5 R10.1
N$4
  Bottom 0.305: PE_BUTTON.2 55.26,22.83 R13.2
N$5
  Bottom 0.305: T9.3 67.24,15.58 R11.2
N$6
  Bottom 0.305: DSP1.C2- 76.95,19.14 75.74,19.14 75.19,19.68 R9.1
N$7
  Bottom 0.305: T10.3 68.74,19.05 67.56,19.05 R12.2
N$8
  Bottom 0.305: T1.K_G 23.5,5.73 R29.1
N$9
  Bottom 0.305: T1.K_R 23.5,8.27 R25.1
N$10
  Bottom 0.305: T2.K_R R17.1
N$11
  Bottom 0.305: C1.1 69.43,77.58 DSP1.VA1+
N$12
  Bottom 0.305: C2.1 71.97,78.05 DSP1.VA0+
N$13
  Bottom 0.305: C3.1 79.59,77.56 DSP1.VB1+
N$14
  Bottom 0.305: C4.1 82.13,78.03 DSP1.VB0+
N$15
  Bottom 0.305: C3.2 77.05,77.53 DSP1.VB1-
N$16
  Bottom 0.305: C4.2 74.51,77.99 DSP1.VB0-
N$17
  Bottom 0.305: T10.1 72.28,19.87 R9.2
N$18
  Bottom 0.305: T9.1 72.01,16.55 R10.2
N$19
  Bottom 0.305: T2.K_G R21.1
N$20
  Top 0.305: T8.K_R 143.73,13.42 141.78,15.38 138.53,15.38 138.2,15.7 R36.1
N$21
  Bottom 0.305: R2.1 63.73,7.8 T3.K_G
N$22
  Bottom 0.305: R5.1 T4.K_R
N$23
  Bottom 0.305: R15.1 93.9,7.82 T4.K_G
N$24
  Top 0.305: R37.1 138.4,18.38 140.69,18.38 T8.K_G
N$25
  Top 0.305: T7.K_R 121.27,23.66 121.77,23.16 126.72,23.16 R34.1
N$26
  Top 0.305: R35.1 126.21,21.49 120.85,21.49 118.73,23.61 T7.K_G
N$27
  Top 0.305: R32.1 142.52,35.02 143.73,33.82 T6.K_R
N$28
  Top 0.305: T6.K_G 142,37.08 R33.1 138.5,36.92
N$29
  Bottom 0.305: T5.K_R 121.27,43.16 R30.1
N$30
  Bottom 0.305: T5.K_G 118.73,43.17 R31.1
N$31
  Bottom 0.305: C1.2 66.89,77.51 DSP1.VA1-
N$32
  Top 0.305: 9.47,6 R19.1 7.08,6.05 LED1.K
N$33
  Top 0.305: LED2.C 9.22,3.69 R38.1
N$34
  Bottom 0.305: C2.2 64.35,77.97 DSP1.VA0-
N$35
  Top 0.305: R40.1 7.78,76.78 6.27,75.27 LED3.K
N$36
  Bottom 0.305: R39.1 C5.1 61.81,77.39 DSP1.VLCD
N$37
  Top 0.305: LED4.C 5.78,72.03 R41.1
PHA0  (via drill 0.3)
  Top 0.305: ENCODER.A R6.2 C28.1 127.62,53.2 v125.8,53.2 | v39.54,28.82 v55.3,28.82 | SV1.11 4.75,24.27 6.21,25.74 9.28,25.74 11.54,28 v12.49,28
  Bottom 0.305: TP1.TP 129.96,59.96 ENCODER.A | v125.8,53.2 124.2,51.6 117.56,51.6 117.32,51.36 117.32,51.03 117.58,50.8 123.11,50.8 123.29,50.61 123.29,50.19 123.11,50 115.6,50 111,45.4 111,30.55 109.27,28.82 v55.3,28.82 | v39.54,28.82 13.32,28.82 v12.49,28
PHB0  (via drill 0.3)
  Top 0.305: R7.2 ENCODER.B | R7.2 C27.1 | v38.8,27.75 v54.2,27.75 | SV1.7 6.18,20.64 12.03,20.64 12.49,21.11 v12.49,26.4 | v133.75,53.06 134.17,53.48 R7.2
  Bottom 0.305: TP2.TP 135.04,59.96 ENCODER.B | v54.2,27.75 109.65,27.75 112,30.11 112,45.05 116,49.05 124.27,49.05 127.82,52.6 133.29,52.6 v133.75,53.06 | v12.49,26.4 13.85,27.75 v38.8,27.75
RESET  (via drill 0.3)
  Top 0.305: v13.6,25.3 13.6,20.44 SV1.4 | v41.4,72.85 41.4,75.55 v41.4,75.98 | v24.69,26.52 24.69,30.18 v25.76,31.24
  Bottom 0.305: DSP1.RST 41.49,76.98 TP10.TP 41.4,76.97 v41.4,75.98 | v13.6,25.3 13.6,26.1 14.02,26.52 v24.69,26.52 | v41.4,72.85 41.4,46.89 v25.76,31.24
SCL0  (via drill 0.3)
  Top 0.305: v50.41,22.2 v58.96,22.2 | PE_CHANNELS.22 130.28,29.25 v130.59,28.94
  Bottom 0.305: v50.41,22.2 PE_BUTTON.22 44.56,22.2 43.76,21.4 7.6,21.4 SV1.10 | TP5.TP 130.58,28.66 | v130.59,28.94 130.58,28.66 | 130.58,28.66 130.58,27.63 125.15,22.2 v58.96,22.2
SDA0  (via drill 0.3)
  Top 0.305: v49.8,23.4 v58.2,23.4 | PE_CHANNELS.23 129.64,30.19 129.56,30.19 v129.53,30.23
  Bottom 0.305: v58.2,23.4 124.6,23.4 128.2,27 128.18,29.11 128.18,29.25 128.35,29.41 128.63,29.41 129.06,28.97 129.41,28.97 129.54,29.11 129.54,30.21 v129.53,30.23 | v49.8,23.4 49.23,22.83 PE_BUTTON.23 8.71,22.83 SV1.12 | v129.53,30.23 129.6,30.15 TP6.TP | v129.54,30.23 v129.53,30.23
SSI0CLK
  Bottom 0.305: DSP1.SCK(D0) 38.95,77.03 TP8.TP 39,76.97 39,48 24,33 5.84,33 SV1.17
SSI0CS
  Bottom 0.305: DSP1.CS0(A2) 44.03,77.03 TP7.TP 44,75.7 43.13,74.83 41.52,74.83 40.2,73.5 40.2,47.6 24.49,31.59 24.39,31.49 7.67,31.49 SV1.18
SSI0MOSI
  Bottom 0.305: TP9.TP 36.41,77.01 DSP1.SDA(D3) | 36.2,77 TP9.TP | TP9.TP 36.4,75.25 36.05,74.9 34.65,74.9 34.3,74.55 34.3,74.17 34.68,73.8 37.2,73.8 37.8,73.2 37.8,48.35 23.88,34.43 SV1.20
STATUS_LED
  Top 0.305: R40.2 R41.2 9.55,73.38 10.45,73.38 10.8,73.02 10.8,32.88 SV1.16
VCC  (via drill 0.3, 0.6)
  Top 0.305: LED4.A 3.73,72.52 LED3.A | R20.1 145.2,30 146.27,28.93 T8.A | 129.01,32.39 PE_CHANNELS.24 129.01,32.99 128.63,33.38 128.17,33.38 | 138.4,41.3 138.6,41.3 138.6,43.55 | T7.A 118.73,13.87 117,15.6 115.2,15.6 113.8,17 113.8,25.47 v112.6,26.67 | T1.A 31.8,8.28 v31.8,14.68 | LED1.A 3.73,4.21 LED2.A | 128.17,33.38 127.38,33.38 v126.8,32.8 | R14.1 128.15,33.39 128.17,33.38
  Top 0.406: R18.1 R1.1 R3.1 126.22,32.23 v126.8,32.8 | R7.1 R8.1 R6.1 130,51.73 v130,50.5 | R20.1 C7.1 139.1,31.1 v138.6,31.6 | 138.4,41.3 R16.1 | v135.17,43.55 138.6,43.55 144.32,43.55 T6.A | v65.99,11.83 65.99,13.26 64.21,15.04 56.08,15.04 | 56.08,15.04 42.6,15.04 v42.44,14.89 | 56.08,7.46 56.08,15.04 | 56.08,7.46 T2.A | 56.08,7.46 58.2,7.46 R26.1 | v36.6,71.69 41.69,71.7 v43.29,71.7 | v50.6,73.61 v45.2,73.61
  Top 0.61: T5.A 118.73,39.89 120.24,41.4 127.85,41.4 v130,43.55
  Top 0.813: v42.45,18.8 v42.45,26.43 42.76,26.43 v47.33,26.43 v57.92,26.43
  Bottom 0.305: DSP1.CS1(A3) 46.6,79.97 C17.1 | T2.A 54.33,5.73 R24.1 | PE_BUTTON.24 46.83,24.28 C6.1 48.52,26.43 v47.33,26.43 | R4.1 R13.1 57.27,25.77 v57.92,26.43 | T3.A 74.35,11.85 74.22,11.98 | LED1.A 3.73,6 7.27,9.54 SV1.2 | TP25.TP 25.6,14.68 | T4.A 81.65,6.5 R28.1
  Bottom 0.406: C17.1 46.48,77.47 46.48,74.88 v45.2,73.61 v43.29,71.7 | LED3.A 5.28,72.45 35.85,72.45 v36.6,71.69 | v138.6,31.6 128,31.6 v126.8,32.8 | v130,50.5 v130,43.55 v135.17,43.55 | R22.1 34.33,5.75 T1.A | v65.99,11.83 66.14,11.98 74.22,11.98 81.14,11.98 82.1,11.02 82.1,8.72 T4.A | DSP1.VDD 52.88,73.61 v50.6,73.61
  Bottom 0.61: v42.45,26.43 42.45,33.46 43.28,34.29 43.28,71.61 v43.29,71.7
  Bottom 0.813: 13.95,14.57 C18.+ | C18.+ 17.6,14.68 C19.1 19.68,14.65 C9.1 25.6,14.68 v31.8,14.68 33.87,14.68 | DSP1.A1+ 33.87,14.68 | v42.45,18.8 42.45,15.06 v42.44,14.89 42.22,14.68 33.87,14.68 | v126.8,32.8 T5.A v112.6,26.67 112.36,26.43 v57.92,26.43 | SV1.2 10.38,14.68 C18.+

### Text on the board
Top: Waveformgenerator V2 TT 0518
Bottom: Waveformgenerator V2 TT 0518
tNames: STATUS | POWER